# Altium schematic sheet NRF51822_Test.SchDoc
size A4
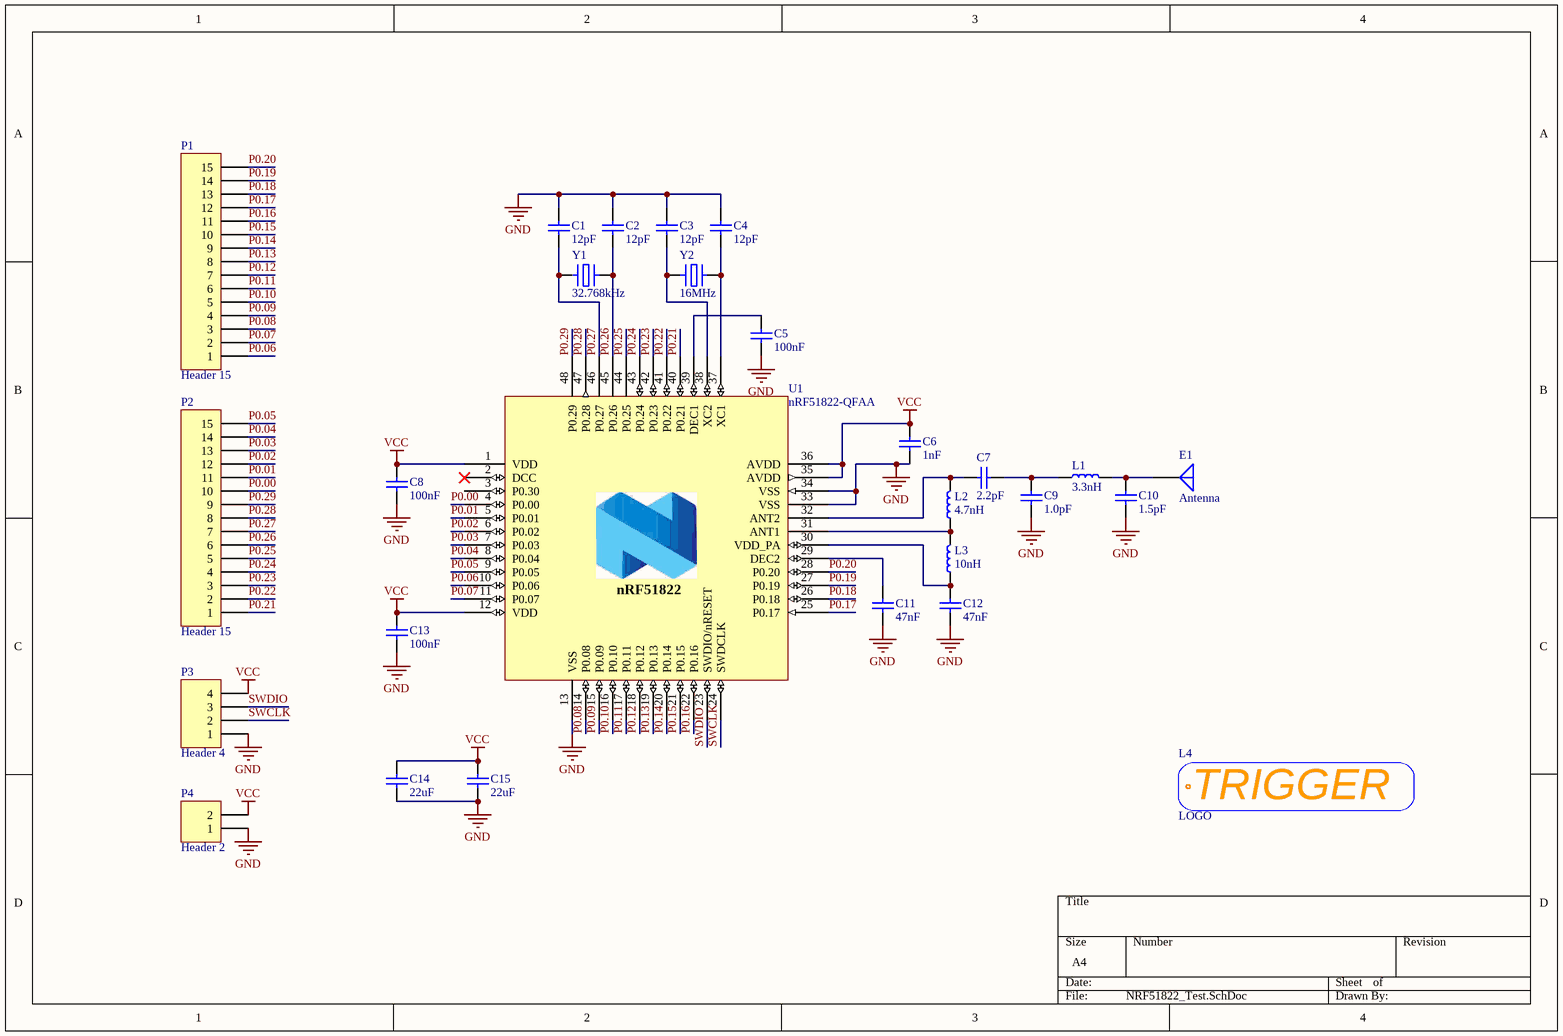
[diagram p0: NRF51822_Test.SchDoc]

## Parts
C1  _Parameter: 12pF  [电容_C0402]  (hidden comment: 104)
C2  _Parameter: 12pF  [电容_C0402]  (hidden comment: 104)
C3  _Parameter: 12pF  [电容_C0402]  (hidden comment: 104)
C4  _Parameter: 12pF  [电容_C0402]  (hidden comment: 104)
C5  _Parameter: 100nF  [电容_C0402]  (hidden comment: 104)
C6  _Parameter: 1nF  [电容_C0402]  (hidden comment: 104)
C7  _Parameter: 2.2pF  [电容_C0402]  (hidden comment: 104)
C8  _Parameter: 100nF  [电容_C0402]  (hidden comment: 104)
C9  _Parameter: 1.0pF  [电容_C0402]  (hidden comment: 104)
C10  _Parameter: 1.5pF  [电容_C0402]  (hidden comment: 104)
C11  _Parameter: 47nF  [电容_C0402]  (hidden comment: 104)
C12  _Parameter: 47nF  [电容_C0402]  (hidden comment: 104)
C13  _Parameter: 100nF  [电容_C0402]  (hidden comment: 104)
C14  _Parameter: 22uF  [电容_C1206]  (hidden comment: 104)
C15  _Parameter: 22uF  [电容_C1206]  (hidden comment: 104)
E1  Antenna  [AN9520]
L1  3.3nH  [变压器电感_L0603]
L2  4.7nH  [变压器电感_L0603]
L3  10nH  [变压器电感_L0603]
L4  LOGO  [LOGO L BS]
P1  Header 15  [HDR1X15]
P2  Header 15  [HDR1X15]
P3  Header 4  [HDR1X4]
P4  Header 2  [HDR1X2]
U1  nRF51822-QFAA  [QFN48 6X6]
Y1  32.768kHz  [晶振_3215]
Y2  16MHz  [晶振_3225]

## Nets
GND: C1.2 C2.2 C3.2 C4.2 C5.1 C6.1 C8.1 C9.2 C10.2 C11.1 C12.1 C13.1 C14.1 C15.1 P3.1 P4.1 U1.0(GND) U1.13(VSS) U1.33(VSS) U1.34(VSS) Y2.0
VCC: C6.2 C8.2 C13.2 C14.2 C15.2 P3.4 P4.2 U1.1(VDD) U1.12(VDD) U1.35(AVDD) U1.36(AVDD)
P0.00: P2.10 U1.4(P0.00)
P0.01: P2.11 U1.5(P0.01)
P0.02: P2.12 U1.6(P0.02)
P0.03: P2.13 U1.7(P0.03)
P0.04: P2.14 U1.8(P0.04)
P0.05: P2.15 U1.9(P0.05)
P0.06: P1.1 U1.10(P0.06)
P0.07: P1.2 U1.11(P0.07)
P0.08: P1.3 U1.14(P0.08)
P0.09: P1.4 U1.15(P0.09)
P0.10: P1.5 U1.16(P0.10)
P0.11: P1.6 U1.17(P0.11)
P0.12: P1.7 U1.18(P0.12)
P0.13: P1.8 U1.19(P0.13)
P0.14: P1.9 U1.20(P0.14)
P0.15: P1.10 U1.21(P0.15)
P0.16: P1.11 U1.22(P0.16)
P0.17: P1.12 U1.25(P0.17)
P0.18: P1.13 U1.26(P0.18)
P0.19: P1.14 U1.27(P0.19)
P0.20: P1.15 U1.28(P0.20)
P0.21: P2.1 U1.40(P0.21)
P0.22: P2.2 U1.41(P0.22)
P0.23: P2.3 U1.42(P0.23)
P0.24: P2.4 U1.43(P0.24)
P0.25: P2.5 U1.44(P0.25)
P0.26: C2.1 P2.6 U1.45(P0.26) Y1.1
P0.27: C1.1 P2.7 U1.46(P0.27) Y1.2
P0.28: P2.8 U1.47(P0.28)
P0.29: P2.9 U1.48(P0.29)
SWCLK: P3.2 U1.24(SWDCLK)
SWDIO: P3.3 U1.23(SWDIO/nRESET)
NetC3_1: C3.1 U1.38(XC2) Y2.1
NetC4_1: C4.1 U1.37(XC1) Y2.2
NetC5_2: C5.2 U1.39(DEC1)
NetC7_1: C7.1 C9.1 L1.1
NetC7_2: C7.2 L2.2 U1.32(ANT2)
NetC10_1: C10.1 E1.1(A) L1.2
NetC11_2: C11.2 U1.29(DEC2)
NetC12_2: C12.2 L3.1 U1.30(VDD_PA)
NetL2_1: L2.1 L3.2 U1.31(ANT1)

Not connected (* = marked no-connect by the designer): U1 2(DCC)* 3(P0.30)

## Notes on the sheet
- (in symbol LOGO_TRIGGER) TRIGGER
- (in symbol nRF51822-QFAA) nRF51822

## Library data of the parts
C1-C15 = Cap: _Material: X7R; _Voltage: 50V; _Slash: /; _Specification: Cap,0805,X7R,104,50V,10%; _Comma: ,; _Accuracy: 10%; _Footprint: 0805; _Capacitance: 104; _Name: Cap
E1 = Antenna: Generic Antenna; Published: 24-Mar-1999; LatestRevisionDate: 17-Jul-2002; LatestRevisionNote: Re-released for DXP Platform.; PackageReference: PIN1; Publisher: Altium Limited
L1 = Inductor Iron: _Comma: ,; _Current: 10A; _Footprint: 1040; _Name: IND; _Specification: IND,1040,3.3nH,10A,20%; _Accuracy: 20%; _Value: 3.3nH
L2 = Inductor Iron: _Comma: ,; _Current: 10A; _Footprint: 1040; _Name: IND; _Specification: IND,1040,4.7nH,10A,20%; _Accuracy: 20%; _Value: 4.7nH
L3 = Inductor Iron: _Comma: ,; _Current: 10A; _Footprint: 1040; _Name: IND; _Specification: IND,1040,10nH,10A,20%; _Accuracy: 20%; _Value: 10nH
L4 = LOGO_TRIGGER
P1 P2 = Header 15: Header, 15-Pin; LatestRevisionDate: 17-Jul-2002; LatestRevisionNote: Re-released for DXP Platform.; Publisher: Altium Limited
P3 = Header 4: Header, 4-Pin; LatestRevisionDate: 17-Jul-2002; LatestRevisionNote: Re-released for DXP Platform.; Publisher: Altium Limited
P4 = Header 2: Header, 2-Pin; LatestRevisionDate: 17-Jul-2002; LatestRevisionNote: Re-released for DXP Platform.; Publisher: Altium Limited
U1 = nRF51822-QFAA: QFN48; _Comma: ,; _Name: MCU; _Specification: MCU,nRF51822-QFAA,QFN48; _Footprint: QFN48; _Model: nRF51822-QFAA
Y1 = XTAL_A: _Name: CRYSTALS; _Comma: ,; _Specification: CRYSTALS,32.768kHz,*,10ppm,12pF; _Accuracy: 10ppm; _CL: 12pF; _Footprint: *; _Frequency: 32.768kHz
Y2 = XTAL_B: _Comma: ,; _Footprint: 5032; _Name: CRYSTALS; _Specification: CRYSTALS,16MHz,5032,10ppm,12pF; _Accuracy: 10ppm; _CL: 12pF; _Frequency: 16MHz